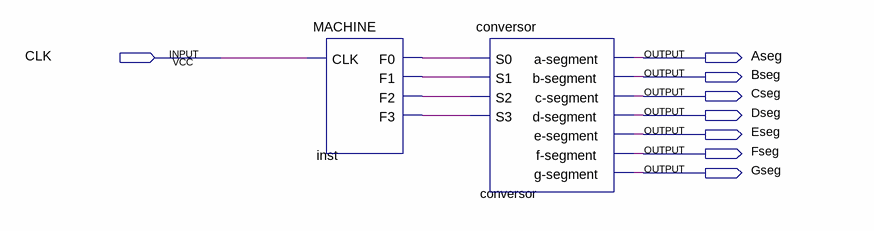
[diagram p0: schematic sheet]
// Quartus schematic stateMachine.bdf as structural Verilog: 2 symbols, 8 pins
module stateMachine (
  input  CLK,
  output Aseg,
  output Bseg,
  output Cseg,
  output Dseg,
  output Eseg,
  output Fseg,
  output Gseg
);

  wire inst_f0, inst_f1, inst_f2, inst_f3;

  MACHINE inst (.CLK(CLK), .F0(inst_f0), .F1(inst_f1), .F2(inst_f2), .F3(inst_f3));
  conversor conversor (
    .S0(inst_f0), .S1(inst_f1), .S2(inst_f2), .S3(inst_f3), .\a-segment (Aseg), .\b-segment (Bseg),
    .\c-segment (Cseg), .\d-segment (Dseg), .\e-segment (Eseg), .\f-segment (Fseg), .\g-segment (Gseg));
endmodule
